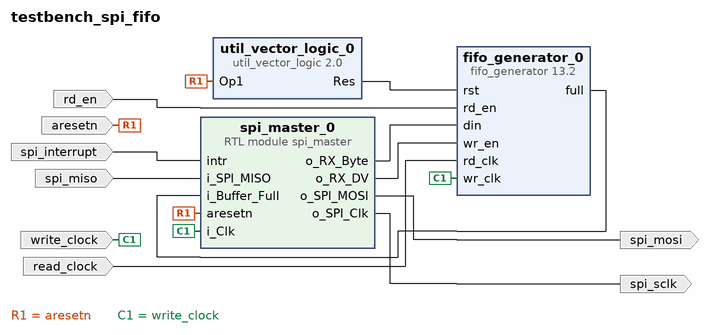
[diagram p0: block diagram of the top level]
# Vivado block design testbench_spi_fifo, xc7z020clg400-1, Vivado 2024.2
create_bd_design testbench_spi_fifo

create_bd_port -dir I aresetn
create_bd_port -dir I spi_miso
create_bd_port -dir I -type clk write_clock
set_property -dict {CONFIG.FREQ_HZ 100000000} [get_bd_ports write_clock]
create_bd_port -dir O spi_mosi
create_bd_port -dir O -type clk spi_sclk
create_bd_port -dir I -type clk read_clock
set_property -dict {CONFIG.FREQ_HZ 100000000} [get_bd_ports read_clock]
create_bd_port -dir I spi_interrupt
create_bd_port -dir I rd_en

create_bd_cell -type ip -vlnv xilinx.com:ip:fifo_generator:13.2 fifo_generator_0
set_property -dict [list \
  CONFIG.Enable_Reset_Synchronization true \
  CONFIG.Fifo_Implementation Independent_Clocks_Block_RAM \
  CONFIG.Input_Data_Width 8 \
  CONFIG.Output_Data_Width 32 \
  CONFIG.Performance_Options Standard_FIFO \
  CONFIG.Write_Acknowledge_Flag true \
] [get_bd_cells fifo_generator_0]
create_bd_cell -type ip -vlnv xilinx.com:ip:util_vector_logic:2.0 util_vector_logic_0
set_property -dict {CONFIG.C_OPERATION not CONFIG.C_SIZE 1} [get_bd_cells util_vector_logic_0]
create_bd_cell -type module -reference spi_master spi_master_0
set_property -dict {CONFIG.SPI_MODE 1} [get_bd_cells spi_master_0]

# ---- connections ----

connect_bd_net [get_bd_ports aresetn] [get_bd_pins util_vector_logic_0/Op1] [get_bd_pins spi_master_0/aresetn]
connect_bd_net [get_bd_pins fifo_generator_0/full] [get_bd_pins spi_master_0/i_Buffer_Full]
connect_bd_net [get_bd_ports rd_en] [get_bd_pins fifo_generator_0/rd_en]
connect_bd_net [get_bd_ports read_clock] [get_bd_pins fifo_generator_0/rd_clk]
connect_bd_net [get_bd_ports spi_interrupt] [get_bd_pins spi_master_0/intr]
connect_bd_net [get_bd_pins spi_master_0/o_RX_Byte] [get_bd_pins fifo_generator_0/din]
connect_bd_net [get_bd_pins spi_master_0/o_RX_DV] [get_bd_pins fifo_generator_0/wr_en]
connect_bd_net [get_bd_pins spi_master_0/o_SPI_Clk] [get_bd_ports spi_sclk]
connect_bd_net [get_bd_pins spi_master_0/o_SPI_MOSI] [get_bd_ports spi_mosi]
connect_bd_net [get_bd_ports spi_miso] [get_bd_pins spi_master_0/i_SPI_MISO]
connect_bd_net [get_bd_pins util_vector_logic_0/Res] [get_bd_pins fifo_generator_0/rst]
connect_bd_net [get_bd_ports write_clock] [get_bd_pins fifo_generator_0/wr_clk] [get_bd_pins spi_master_0/i_Clk]

validate_bd_design
save_bd_design
